# Altium project Timingcard_PROJECT_v9.PrjPcb (part 2 of 2)

## Sheet 08-DIPSwitches_I2C.SchDoc
size B
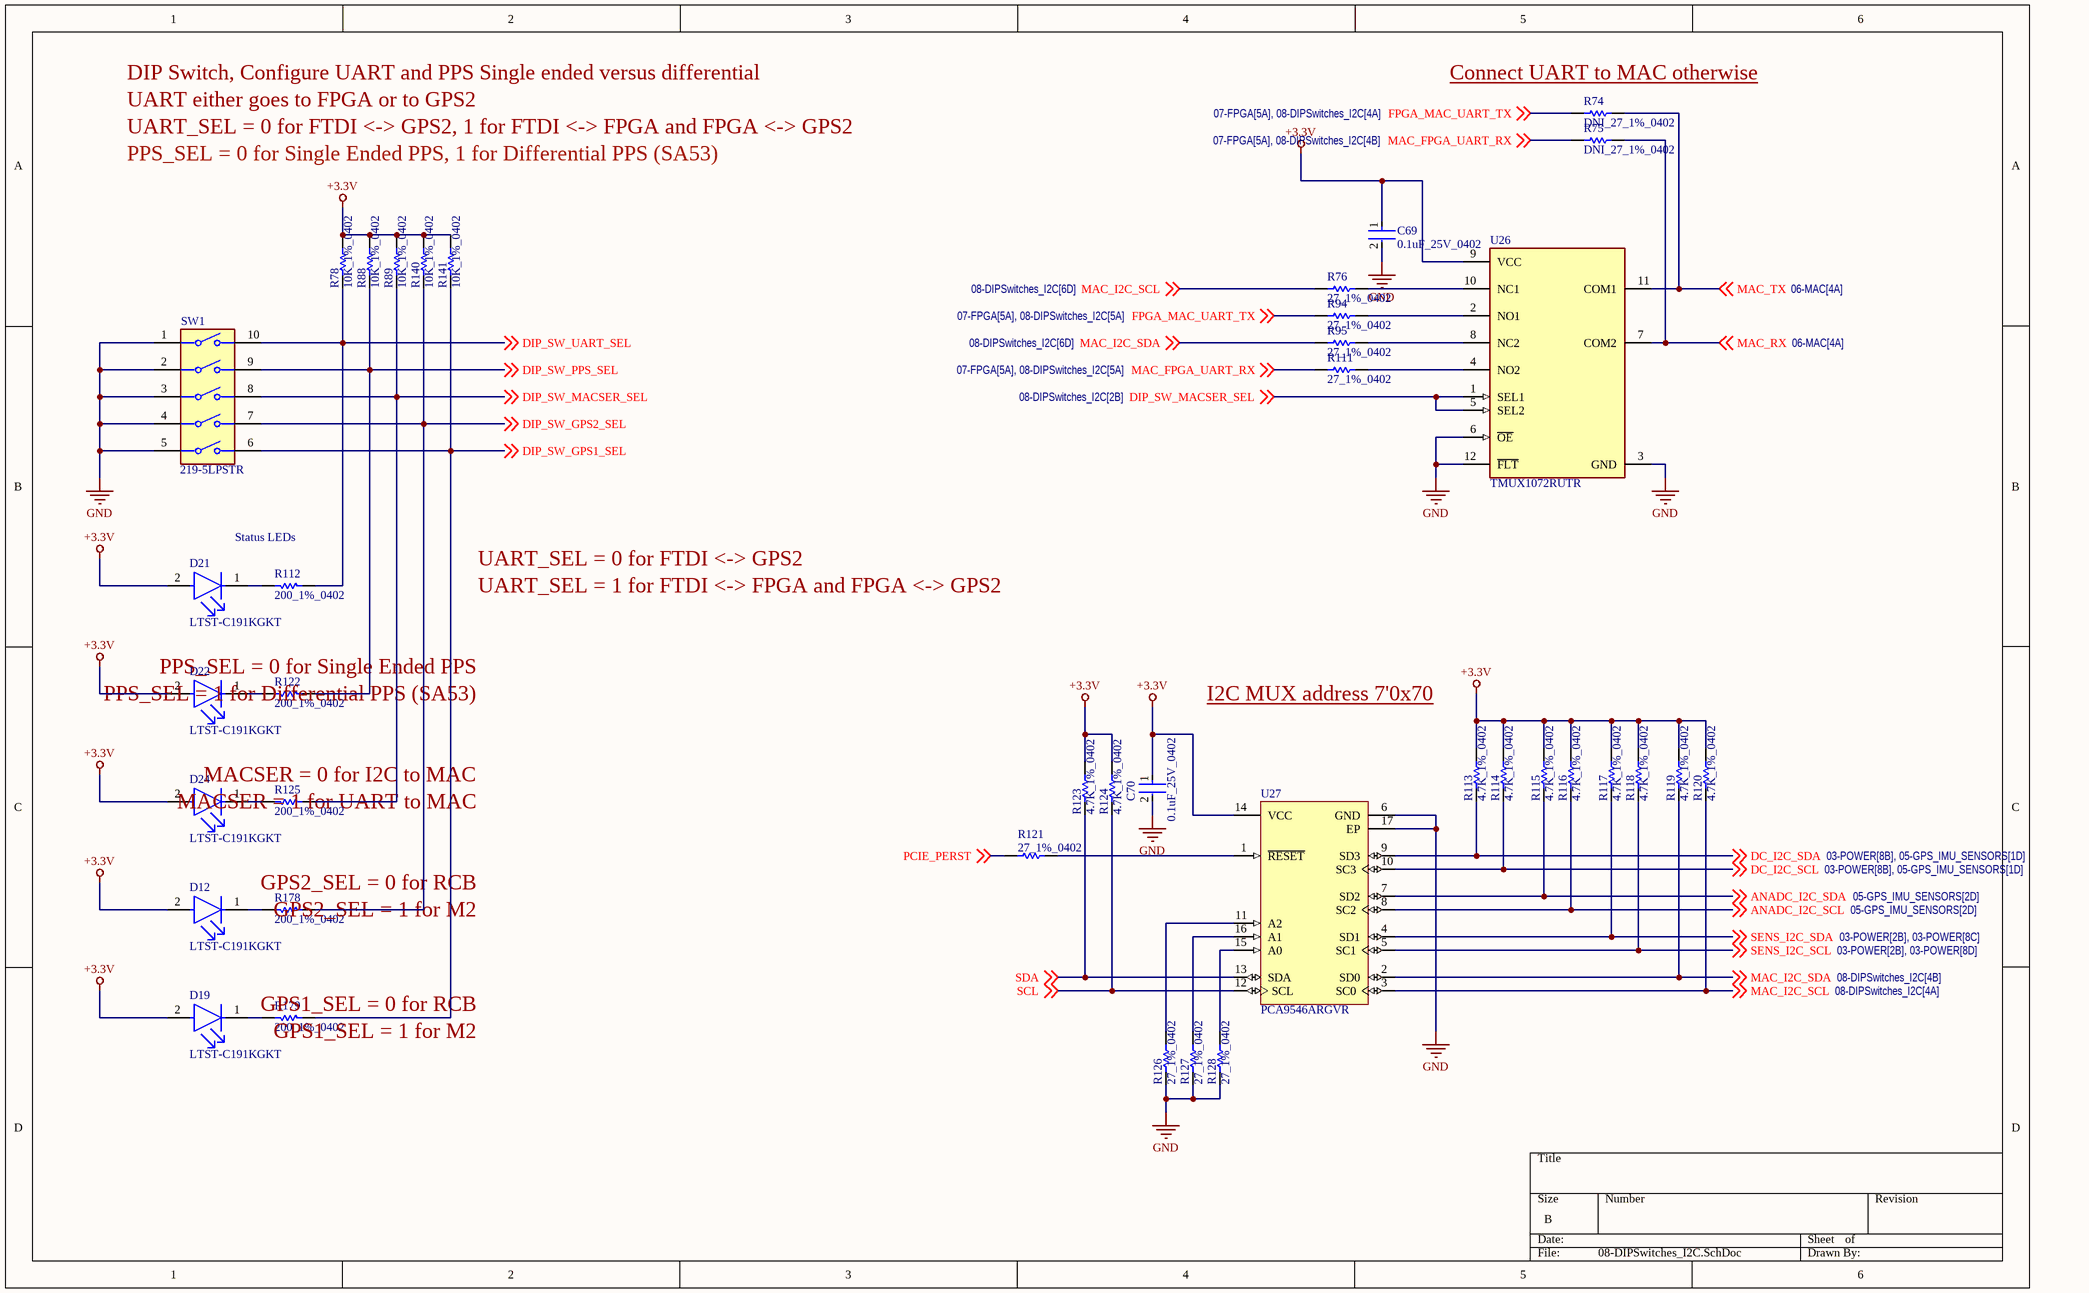
[diagram p4: 08-DIPSwitches_I2C.SchDoc]

### Parts
C69  0.1uF_25V_0402  [FP-0402-L_1_0_1-W_0_5_0_1-IPC_C]
C70  0.1uF_25V_0402  [FP-0402-L_1_0_1-W_0_5_0_1-IPC_C]
D12  LTST-C191KGKT  [FP-LTST-C191KGKT-MFG]
D19  LTST-C191KGKT  [FP-LTST-C191KGKT-MFG]
D21  LTST-C191KGKT  [FP-LTST-C191KGKT-MFG]
D22  LTST-C191KGKT  [FP-LTST-C191KGKT-MFG]
D24  LTST-C191KGKT  [FP-LTST-C191KGKT-MFG]
R74  DNI_27_1%_0402  [RESC1005X40X25NL05T05]  (no BOM)
R75  DNI_27_1%_0402  [RESC1005X40X25NL05T05]  (no BOM)
R76  27_1%_0402  [RESC1005X40X25NL05T05]
R78  10K_1%_0402  [RESC1005X40X25LL05T10]
R88  10K_1%_0402  [RESC1005X40X25LL05T10]
R89  10K_1%_0402  [RESC1005X40X25LL05T10]
R94  27_1%_0402  [RESC1005X40X25NL05T05]
R95  27_1%_0402  [RESC1005X40X25NL05T05]
R111  27_1%_0402  [RESC1005X40X25NL05T05]
R112  200_1%_0402  [RESC1005X40X25NL05T05]
R113  4.7K_1%_0402  [RESC1005X40X25NL10T10]
R114  4.7K_1%_0402  [RESC1005X40X25NL10T10]
R115  4.7K_1%_0402  [RESC1005X40X25NL10T10]
R116  4.7K_1%_0402  [RESC1005X40X25NL10T10]
R117  4.7K_1%_0402  [RESC1005X40X25NL10T10]
R118  4.7K_1%_0402  [RESC1005X40X25NL10T10]
R119  4.7K_1%_0402  [RESC1005X40X25NL10T10]
R120  4.7K_1%_0402  [RESC1005X40X25NL10T10]
R121  27_1%_0402  [RESC1005X40X25NL05T05]
R122  200_1%_0402  [RESC1005X40X25NL05T05]
R123  4.7K_1%_0402  [RESC1005X40X25NL10T10]
R124  4.7K_1%_0402  [RESC1005X40X25NL10T10]
R125  200_1%_0402  [RESC1005X40X25NL05T05]
R126  27_1%_0402  [RESC1005X40X25NL05T05]
R127  27_1%_0402  [RESC1005X40X25NL05T05]
R128  27_1%_0402  [RESC1005X40X25NL05T05]
R140  10K_1%_0402  [RESC1005X40X25LL05T10]
R141  10K_1%_0402  [RESC1005X40X25LL05T10]
R178  200_1%_0402  [RESC1005X40X25NL05T05]
R179  200_1%_0402  [RESC1005X40X25NL05T05]
SW1  219-5LPSTR  [FP-219-5LPSTR-MFG]
U26  TMUX1072RUTR  [FP-RUT0012A-MFG]
U27  PCA9546ARGVR  [RGV0016A_V]

### Nets
+3.3V: C69.1 C70.1 D12.2(A) D19.2(A) D21.2(A) D22.2(A) D24.2(A) R78.1 R88.1 R89.1 R113.2 R114.2 R115.2 R116.2 R117.2 R118.2 R119.2 R120.2 R123.2 R124.2 R140.1 R141.1 U26.9(VCC) U27.14(VCC)
GND: C69.2 C70.2 R126.1 R127.1 R128.1 SW1.1 SW1.2 SW1.3 SW1.4 SW1.5 U26.3(GND) U26.6(~{OE}) U26.12(~{FLT}) U27.6(GND) U27.17(EP)
ANADC_I2C_SCL: R116.1 U27.8(SC2) ; off-sheet ANADC_I2C_SCL
ANADC_I2C_SDA: R115.1 U27.7(SD2) ; off-sheet ANADC_I2C_SDA
DC_I2C_SCL: R114.1 U27.10(SC3) ; off-sheet DC_I2C_SCL
DC_I2C_SDA: R113.1 U27.9(SD3) ; off-sheet DC_I2C_SDA
DIP_SW_GPS1_SEL: R141.2 R179.2 SW1.6 ; off-sheet DIP_SW_GPS1_SEL
DIP_SW_GPS2_SEL: R140.2 R178.2 SW1.7 ; off-sheet DIP_SW_GPS2_SEL
DIP_SW_MACSER_SEL: R89.2 R125.2 SW1.8 U26.1(SEL1) U26.5(SEL2) ; off-sheet DIP_SW_MACSER_SEL
DIP_SW_PPS_SEL: R88.2 R122.2 SW1.9 ; off-sheet DIP_SW_PPS_SEL
DIP_SW_UART_SEL: R78.2 R112.2 SW1.10 ; off-sheet DIP_SW_UART_SEL
FPGA_MAC_UART_TX: R74.1 R94.1 ; off-sheet FPGA_MAC_UART_TX
MAC_FPGA_UART_RX: R75.1 R111.1 ; off-sheet MAC_FPGA_UART_RX
MAC_I2C_SCL: R76.1 R120.1 U27.3(SC0) ; off-sheet MAC_I2C_SCL
MAC_I2C_SDA: R95.1 R119.1 U27.2(SD0) ; off-sheet MAC_I2C_SDA
MAC_RX: R75.2 U26.7(COM2) ; off-sheet MAC_RX
MAC_TX: R74.2 U26.11(COM1) ; off-sheet MAC_TX
PCIE_PERST: R121.1 ; off-sheet PCIE_PERST
SCL: R124.1 U27.12(SCL) ; off-sheet SCL
SDA: R123.1 U27.13(SDA) ; off-sheet SDA
SENS_I2C_SCL: R118.1 U27.5(SC1) ; off-sheet SENS_I2C_SCL
SENS_I2C_SDA: R117.1 U27.4(SD1) ; off-sheet SENS_I2C_SDA
NetD12_1: D12.1(C) R178.1
NetD19_1: D19.1(C) R179.1
NetD21_1: D21.1(C) R112.1
NetD22_1: D22.1(C) R122.1
NetD24_1: D24.1(C) R125.1
NetR76_2: R76.2 U26.10(NC1)
NetR94_2: R94.2 U26.2(NO1)
NetR95_2: R95.2 U26.8(NC2)
NetR111_2: R111.2 U26.4(NO2)
NetR121_2: R121.2 U27.1(~{RESET})
NetR126_2: R126.2 U27.11(A2)
NetR127_2: R127.2 U27.16(A1)
NetR128_2: R128.2 U27.15(A0)

### Notes on the sheet
- DIP Switch, Configure UART and PPS Single ended versus differential
- Connect UART to MAC otherwise
- UART either goes to FPGA or to GPS2
- UART_SEL = 0 for FTDI <-> GPS2, 1 for FTDI <-> FPGA and FPGA <-> GPS2
- PPS_SEL = 0 for Single Ended PPS, 1 for Differential PPS (SA53)
- Status LEDs
- UART_SEL = 0 for FTDI <-> GPS2
- UART_SEL = 1 for FTDI <-> FPGA and FPGA <-> GPS2
- PPS_SEL = 0 for Single Ended PPS
- PPS_SEL = 1 for Differential PPS (SA53)
- I2C MUX address 7'0x70
- MACSER = 0 for I2C to MAC
- MACSER = 1 for UART to MAC
- GPS2_SEL = 0 for RCB
- GPS2_SEL = 1 for M2
- GPS1_SEL = 0 for RCB
- GPS1_SEL = 1 for M2

### Library data of the parts
C69 C70 = CMP-2008-02519-2: General Purpose Ceramic Capacitor, 0402, 100nF, 10%, X7R, 15%, 25V; Package Quantity: 1; Capacitance: 100nF; Min Operating Temperature: -55°C; Voltage: 25V; Voltage Rating: 25V; Construction: Flat; Max Operating Temperature: 125°C; Radiation Hardening: No; Depth: 0.5mm; Thickness: 0.022inch; Voltage Rating (DC): 25V; Number of Pins: 2; Lead Free: Lead Free; Series: -; REACH SVHC: No SVHC; Length: 1mm; Dielectric: X7R; RoHS Compliant: Yes; Mount: Surface Mount; Packaging: Tape and Reel; Case/Package: 0402; Case Code (Imperial): 0402; Termination: SMD/SMT; Width: 0.02inch; Case Code (Metric): 1005; Tolerance: 10%
D12 D19 D21 D22 D24 = CMP-2000-05198-2: LED GREEN CLEAR SMD; Max Power Dissipation: 75mW; Forward Current: 30mA; Reverse Voltage: 5V; Lens Color: Colorless; Forward Voltage: 2V; Dominant Wavelength: 571nm; Number of LEDs: 1; Viewing Angle: 130°; Lens Style: Rectangular; Test Current: 20mA; Luminous Intensity: 35mcd; Wavelength: 574nm; Width: 0.8mm; Case Code (Imperial): 0603; Number of Pins: 2; Lead Free: Lead Free; Packaging: Tape and Reel; Package Quantity: 1; Min Operating Temperature: -55°C; Case/Package: 0603; Length: 1.6mm; Power Dissipation: 75mW; Depth: 0.8mm; Radiation Hardening: No; Mount: Surface Mount; Max Operating Temperature: 85°C; Color: Green; Power Rating: 75mW; Height: 0.55mm; Illumination Color: Green; Case Code (Metric): 1608; Lens Transparency: Clear; Number of Elements: 1
R74-R76 R94 R95 R111 R121 R126-R128 = CMP-2002-08434-1: Part Number: CRCW040227R0FKED; Manufacturer: Vishay Dale
R78 R88 R89 R140 R141 = CMP-2002-07353-1: Part Number: RC0402FR-0710KL; Manufacturer: Yageo / Phycomp
R112 R122 R125 R178 R179 = CMP-2002-08352-1: Manufacturer: Vishay Dale; Part Number: CRCW0402200RFKTD
R113-R120 R123 R124 = CMP-2002-05217-1: Manufacturer: Bourns; Part Number: CR0402-FX-4701GLF
SW1 = CMP-07018-000003-1: SWITCH SLIDE DIP SPST 100MA 20V; Pitch: 0.1inch; Actuator Type: Slide (Standard); Washable: Yes; Number of Positions: 5; Electrical Life: 2000Cycles; Packaging: Tape and Reel; Lead Free: Lead Free; Contact Plating: Gold; Max Operating Temperature: 85°C; Length: 0.558inch; Package Quantity: 1000; Orientation: Straight; Max Current Rating: 100mA; Min Operating Temperature: -55°C; Radiation Hardening: No; Mount: Surface Mount; Current Rating: 100mA; Termination: Gull Wing; Contact Material: Copper; Max Voltage Rating (DC): 20V; Voltage Rating (DC): 20V; Depth: 9.91mm; Mechanical Life: 2000Cycles; Throw Configuration: SPST
U26 = CMP-04892-000114-1: IC SWITCH SPDT DUAL 12UQFN; Number of Circuits: 2; -3db Bandwidth: 1.2GHz; On-State Resistance: 18R; Number of Pins: 12; Min Operating Temperature: -40°C; RoHS Compliant: Yes; Max Operating Temperature: 125°C; Number of Channels: 2; Packaging: Tape and Reel
U27 = CMP-0314-00065-2: 4-Channel I2C and SMBus Multiplexer with Reset Functions, 2.3 to 5.5 V, -40 to 85 degC, 16-pin VQFN (RGV), Green (RoHS & no Sb/Br); Manufacturer: Texas Instruments; fSCLK(Max)(MHz): 100, 400; I2C Address: 1110 xxx; VCC(Min)(V): 2.3; 5V Tolerant I/O: Yes; Channel Width: 4; VCC(Max)(V): 5.5; tpd max(ns): 0.3, 1; Simultaneously Active Channels: 1 to 4; Max Frequency(kHz): 400; SubFamily: I2C Multiplexer, Switch; Mounting Technology: Surface Mount; ComponentLink2Description: Package Specification; DatasheetVersion: SCPS148E; PackageDescription: 16-Pin Plastic Quad Flat No-Lead, 4 x 4 mm Body, 0.65 mm Pitch, 2.16 x 2.16 mm Exposed Pad; PackageVersion: revF, Jun-2011; ComponentLink1URL: http://www.ti.com/general/docs/lit/getliterature.tsp?genericPartNumber=PCA9546A&fileType=pdf; Eco-Plan: Green (RoHS & no Sb/Br); Reset Input: Yes; Vcc range(V): 2.3 to 5.5; ComponentLink2URL: http://www.ti.com/litv/pdf/mpds178g; Open Drain I/O Type: Yes; PackageReference: RGV0016A; PartNumber: PCA9546ARGVR; ComponentLink1Description: Datasheet

## Nets that join several sheets
+3.3V: 01-USER_IO (18 pins), 02-USER_IO_STATUS (15 pins), 05-GPS_IMU_SENSORS (18 pins), 08-DIPSwitches_I2C (24 pins)
+5.0V: 05-GPS_IMU_SENSORS (11 pins), 07-FPGA (8 pins)
GND: 01-USER_IO (34 pins), 02-USER_IO_STATUS (10 pins), 05-GPS_IMU_SENSORS (50 pins), 07-FPGA (56 pins), 08-DIPSwitches_I2C (15 pins)
ANADC_I2C_SCL: 05-GPS_IMU_SENSORS (P1.3), 08-DIPSwitches_I2C (R116.1 U27.8)
ANADC_I2C_SDA: 05-GPS_IMU_SENSORS (P1.4), 08-DIPSwitches_I2C (R115.1 U27.7)
ANT1_IN: 01-USER_IO (U8.3), 07-FPGA (J35.21)
ANT1_IO_IN: 01-USER_IO (R15.2 U8.7), 07-FPGA (J36.33)
ANT1_IO_OUT: 01-USER_IO (R14.2 U8.1), 07-FPGA (J36.31)
ANT1_OUT: 01-USER_IO (U8.2), 07-FPGA (J35.15)
ANT2_IN: 01-USER_IO (U12.3), 07-FPGA (J35.23)
ANT2_IO_IN: 01-USER_IO (R30.2 U12.7), 07-FPGA (J36.37)
ANT2_IO_OUT: 01-USER_IO (R29.2 U12.1), 07-FPGA (J36.35)
ANT2_OUT: 01-USER_IO (U12.2), 07-FPGA (J35.17)
ANT3_IN: 01-USER_IO (U11.3), 07-FPGA (J35.16)
ANT3_IO_IN: 01-USER_IO (R16.2 U11.7), 07-FPGA (J36.43)
ANT3_IO_OUT: 01-USER_IO (R17.2 U11.1), 07-FPGA (J36.41)
ANT3_OUT: 01-USER_IO (U11.2), 07-FPGA (J35.25)
ANT4_IN: 01-USER_IO (U16.3), 07-FPGA (J35.18)
ANT4_IO_IN: 01-USER_IO (R32.2 U16.7), 07-FPGA (J36.47)
ANT4_IO_OUT: 01-USER_IO (R31.2 U16.1), 07-FPGA (J36.45)
ANT4_OUT: 01-USER_IO (U16.2), 07-FPGA (J35.27)
BNO_INT: 05-GPS_IMU_SENSORS (R50.2 U13.14), 07-FPGA (J35.63)
DC_I2C_SCL: 05-GPS_IMU_SENSORS (P5.3), 08-DIPSwitches_I2C (R114.1 U27.10)
DC_I2C_SDA: 05-GPS_IMU_SENSORS (P5.4), 08-DIPSwitches_I2C (R113.1 U27.9)
EXT_EEPROM_WP: 05-GPS_IMU_SENSORS (R37.1 U7.5), 07-FPGA (J34.44)
FPGA_BNO_XIN32: 05-GPS_IMU_SENSORS (R71.2), 07-FPGA (J35.36)
FPGA_BNO_XOUT32: 05-GPS_IMU_SENSORS (R73.2), 07-FPGA (J35.38)
FPGA_MAC_UART_TX: 07-FPGA (J35.26), 08-DIPSwitches_I2C (R74.1 R94.1)
GPS1_PIN13: 05-GPS_IMU_SENSORS (J6.13), 07-FPGA (J35.2)
GPS1_PIN14: 05-GPS_IMU_SENSORS (J6.14), 07-FPGA (J35.3)
GPS1_PIN15: 05-GPS_IMU_SENSORS (J6.15), 07-FPGA (J35.1)
GPS1_RST: 05-GPS_IMU_SENSORS (J6.4 U9.4), 07-FPGA (J34.22)
GPS2_PIN13: 05-GPS_IMU_SENSORS (J13.13), 07-FPGA (J35.73)
GPS2_PIN14: 05-GPS_IMU_SENSORS (J13.14), 07-FPGA (J35.78)
GPS2_PIN15: 05-GPS_IMU_SENSORS (J13.15), 07-FPGA (J35.65)
GPS2_RST: 05-GPS_IMU_SENSORS (J13.4 U15.4), 07-FPGA (J36.11)
LED1: 02-USER_IO_STATUS (R35.1), 07-FPGA (J34.77)
LED2: 02-USER_IO_STATUS (R36.1), 07-FPGA (J34.75)
LED3: 02-USER_IO_STATUS (R38.1), 07-FPGA (J34.73)
LED4: 02-USER_IO_STATUS (R39.1), 07-FPGA (J34.71)
MAC_FPGA_UART_RX: 07-FPGA (J35.28), 08-DIPSwitches_I2C (R75.1 R111.1)
PCIE_PERST: 05-GPS_IMU_SENSORS (R54.1), 07-FPGA (J36.21), 08-DIPSwitches_I2C (R121.1)
SCL: 05-GPS_IMU_SENSORS (U7.1), 07-FPGA (J35.67), 08-DIPSwitches_I2C (R124.1 U27.12)
SDA: 05-GPS_IMU_SENSORS (U7.3), 07-FPGA (J35.61), 08-DIPSwitches_I2C (R123.1 U27.13)
SENS1_I2C_SCL: 02-USER_IO_STATUS (U6.7), 05-GPS_IMU_SENSORS (U13.19 U14.4)
SENS1_I2C_SDA: 02-USER_IO_STATUS (U6.6), 05-GPS_IMU_SENSORS (U13.20 U14.3)